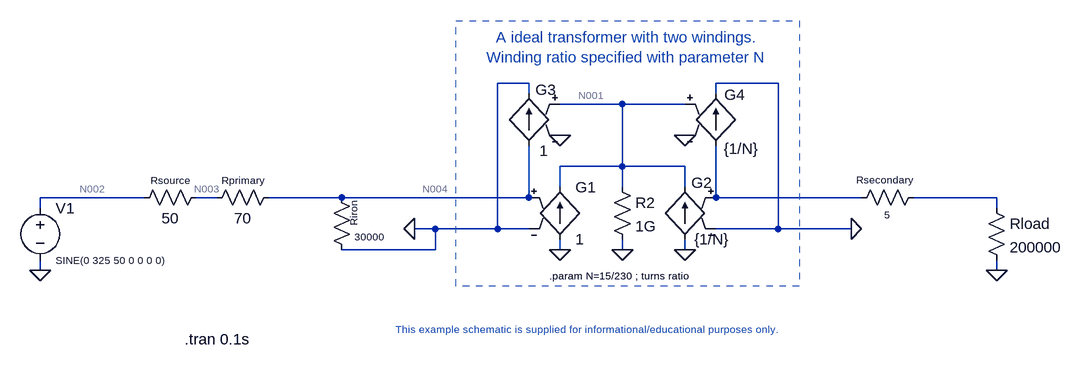
[diagram p0: schematic NON_IdealTransformer.asc]
NON_IdealTransformer.asc, the LTspice schematic file:
Version 4
SHEET 1 992 680
WIRE 160 0 112 0
WIRE 544 0 448 0
WIRE 160 16 160 0
WIRE 448 16 448 0
WIRE 304 32 208 32
WIRE 400 32 304 32
WIRE 304 128 304 32
WIRE 304 128 208 128
WIRE 400 128 304 128
WIRE 208 160 208 128
WIRE 304 160 304 128
WIRE 400 160 400 128
WIRE -432 176 -592 176
WIRE -320 176 -352 176
WIRE -128 176 -240 176
WIRE 160 176 160 96
WIRE 160 176 -128 176
WIRE 448 176 448 96
WIRE 672 176 448 176
WIRE 880 176 752 176
WIRE -592 192 -592 176
WIRE 880 192 880 176
WIRE 16 224 -16 224
WIRE 112 224 112 0
WIRE 112 224 16 224
WIRE 160 224 112 224
WIRE 544 224 544 0
WIRE 544 224 448 224
WIRE 656 224 544 224
WIRE 16 256 16 224
WIRE 16 256 -128 256
WIRE 208 256 208 240
WIRE 304 256 304 240
WIRE 400 256 400 240
WIRE -592 288 -592 272
WIRE 880 288 880 272
FLAG -592 288 0
FLAG 400 256 0
FLAG 208 256 0
FLAG 208 80 0
FLAG 400 80 0
FLAG 304 256 0
FLAG -16 224 0
FLAG 656 224 0
FLAG 880 288 0
SYMBOL voltage -592 176 R0
WINDOW 3 24 96 Left 1
WINDOW 123 0 0 Left 0
WINDOW 39 0 0 Left 0
SYMATTR InstName V1
SYMATTR Value SINE(0 325 50 0 0 0 0)
SYMBOL res -336 160 R90
WINDOW 0 0 56 VBottom 1
WINDOW 3 32 56 VTop 2
SYMATTR InstName Rsource
SYMATTR Value 50
SYMBOL g 208 144 R0
SYMATTR InstName G1
SYMATTR Value 1
SYMBOL g 400 144 M0
WINDOW 0 -10 9 Right 2
WINDOW 3 -15 96 Right 2
SYMATTR InstName G2
SYMATTR Value {1/N}
SYMBOL g 160 0 M0
WINDOW 0 -10 10 Right 2
WINDOW 3 -16 104 Right 2
SYMATTR InstName G3
SYMATTR Value 1
SYMBOL g 448 0 R0
WINDOW 0 13 18 Left 2
WINDOW 3 12 101 Left 2
SYMATTR InstName G4
SYMATTR Value {1/N}
SYMBOL res 288 144 R0
SYMATTR InstName R2
SYMATTR Value 1G
SYMBOL res 864 176 R0
SYMATTR InstName Rload
SYMATTR Value 200000
SYMBOL res -224 160 R90
WINDOW 0 0 56 VBottom 1
WINDOW 3 32 56 VTop 2
SYMATTR InstName Rprimary
SYMATTR Value 70
SYMBOL res 768 160 R90
WINDOW 0 -22 61 VTop 1
WINDOW 3 32 56 VTop 1
SYMATTR InstName Rsecondary
SYMATTR Value 5
SYMBOL res -144 160 R0
WINDOW 0 45 40 VBottom 1
WINDOW 3 81 76 Right 1
SYMATTR InstName Riron
SYMATTR Value 30000
TEXT 240 368 Top 1 ;This example schematic is supplied for informational/educational purposes only.
TEXT 312 -24 Bottom 2 ;A ideal transformer with two windings.\nWinding ratio specified with parameter N
TEXT 192 296 Left 1 !.param N=15/230 ; turns ratio
TEXT -370 394 Left 2 !.tran 0.1s
RECTANGLE Normal 576 312 48 -96 2

The netlist it stands for:
* NON_IdealTransformer.asc
V1 N002 0 SINE(0 325 50 0 0 0 0)
Rsource N003 N002 50
G1 0 N001 N004 0 1
G2 0 N001 N005 0 {1/N}
G3 N004 0 N001 0 1
G4 N005 0 N001 0 {1/N}
R2 N001 0 1G
Rload N006 0 200000
Rprimary N004 N003 70
Rsecondary N006 N005 5
Riron N004 0 30000
* This example schematic is supplied for informational/educational purposes only.
* A ideal transformer with two windings.
* Winding ratio specified with parameter N
.param N=15/230 ; turns ratio
.tran 0.1s
.backanno
.end

* Results of the author's LTspice run, read from the files saved beside the schematic
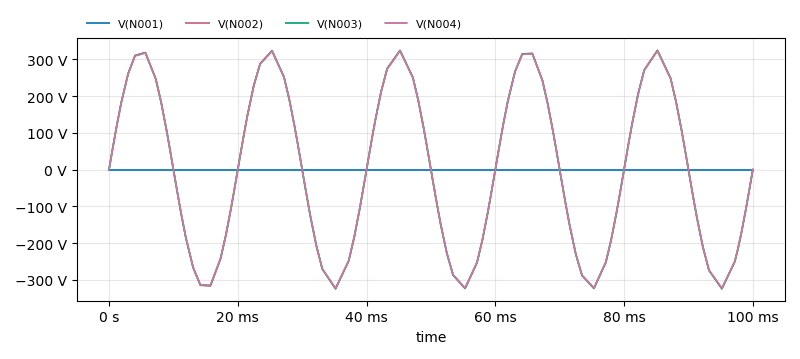
[diagram p1: Transient Analysis of NON_IdealTransformer.asc, plotted from the saved traces]
* Transient Analysis, 1 run:
*   V(N001): min -6.864 µV, max 6.864 µV, average 1.782 nV, rms 4.791 µV, last 0 V
*   V(N002): min -324.1 V, max 324.1 V, average 84.14 mV, rms 226.3 V, last 0 V
*   V(N003): min -323.5 V, max 323.5 V, average 83.98 mV, rms 225.8 V, last 0 V
*   V(N004): min -322.7 V, max 322.7 V, average 83.78 mV, rms 225.3 V, last 0 V